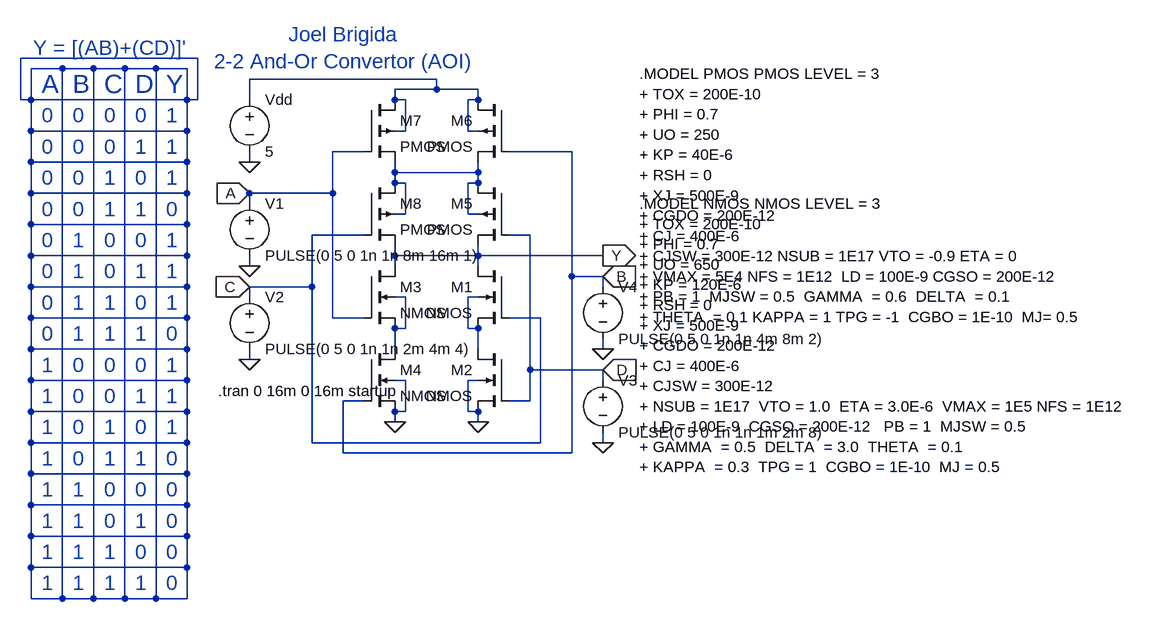
[diagram p0: schematic AOI2-2.asc]
AOI2-2.asc, the LTspice schematic file:
Version 4
SHEET 1 1204 680
WIRE -80 -208 -352 -208
WIRE -288 -192 -336 -192
WIRE -240 -192 -288 -192
WIRE -192 -192 -240 -192
WIRE -144 -192 -192 -192
WIRE -96 -192 -144 -192
WIRE 288 -176 0 -176
WIRE 288 -160 288 -176
WIRE 288 -160 224 -160
WIRE 352 -160 288 -160
WIRE -352 -144 -352 -208
WIRE -336 -144 -336 -192
WIRE -336 -144 -352 -144
WIRE -96 -144 -96 -192
WIRE -96 -144 -336 -144
WIRE -80 -144 -80 -208
WIRE -80 -144 -96 -144
WIRE 0 -144 0 -176
WIRE 224 -144 224 -160
WIRE 240 -144 224 -144
WIRE 352 -144 352 -160
WIRE 352 -144 336 -144
WIRE -336 -96 -336 -144
WIRE -96 -96 -96 -144
WIRE -96 -96 -336 -96
WIRE 240 -96 240 -144
WIRE 240 -96 224 -96
WIRE 336 -96 336 -144
WIRE 352 -96 336 -96
WIRE 176 -64 128 -64
WIRE 496 -64 400 -64
WIRE -336 -48 -336 -96
WIRE -96 -48 -96 -96
WIRE -96 -48 -336 -48
WIRE 0 -48 0 -64
WIRE 224 -32 224 -48
WIRE 352 -32 352 -48
WIRE 352 -32 224 -32
WIRE 224 -16 224 -32
WIRE 240 -16 224 -16
WIRE 352 -16 352 -32
WIRE 352 -16 336 -16
WIRE -336 0 -336 -48
WIRE -96 0 -96 -48
WIRE -96 0 -336 0
WIRE 128 0 128 -64
WIRE 128 0 0 0
WIRE 0 16 0 0
WIRE 240 32 240 -16
WIRE 240 32 224 32
WIRE 336 32 336 -16
WIRE 352 32 336 32
WIRE -336 48 -336 0
WIRE -96 48 -96 0
WIRE -96 48 -336 48
WIRE 176 64 96 64
WIRE 432 64 400 64
WIRE -336 96 -336 48
WIRE -96 96 -96 48
WIRE -96 96 -336 96
WIRE 224 96 224 80
WIRE 352 96 352 80
WIRE 352 96 224 96
WIRE 544 96 352 96
WIRE 0 112 0 96
WIRE 224 112 224 96
WIRE 352 112 352 96
WIRE 496 128 496 -64
WIRE 544 128 496 128
WIRE -336 144 -336 96
WIRE -96 144 -96 96
WIRE -96 144 -336 144
WIRE 96 144 96 64
WIRE 96 144 0 144
WIRE 544 144 544 128
WIRE 0 160 0 144
WIRE 240 160 224 160
WIRE 352 160 336 160
WIRE -336 192 -336 144
WIRE -96 192 -96 144
WIRE -96 192 -336 192
WIRE 128 192 128 0
WIRE 176 192 128 192
WIRE 448 192 400 192
WIRE 240 208 240 160
WIRE 240 208 224 208
WIRE 336 208 336 160
WIRE 352 208 336 208
WIRE -336 240 -336 192
WIRE -96 240 -96 192
WIRE -96 240 -336 240
WIRE 224 240 224 208
WIRE 352 240 352 208
WIRE 544 240 544 224
WIRE 0 256 0 240
WIRE 432 272 432 64
WIRE 544 272 432 272
WIRE -336 288 -336 240
WIRE -96 288 -96 240
WIRE -96 288 -336 288
WIRE 240 288 224 288
WIRE 352 288 336 288
WIRE 544 288 544 272
WIRE 176 320 144 320
WIRE 432 320 432 272
WIRE 432 320 400 320
WIRE -336 336 -336 288
WIRE -96 336 -96 288
WIRE -96 336 -336 336
WIRE 240 336 240 288
WIRE 240 336 224 336
WIRE 336 336 336 288
WIRE 352 336 336 336
WIRE 224 352 224 336
WIRE 352 352 352 336
WIRE -336 384 -336 336
WIRE -96 384 -96 336
WIRE -96 384 -336 384
WIRE 96 384 96 144
WIRE 448 384 448 192
WIRE 448 384 96 384
WIRE 544 384 544 368
WIRE 144 400 144 320
WIRE 496 400 496 128
WIRE 496 400 144 400
WIRE -336 432 -336 384
WIRE -96 432 -96 384
WIRE -96 432 -336 432
WIRE -336 480 -336 432
WIRE -96 480 -96 432
WIRE -96 480 -336 480
WIRE -336 528 -336 480
WIRE -96 528 -96 480
WIRE -96 528 -336 528
WIRE -336 576 -336 528
WIRE -96 576 -96 528
WIRE -96 576 -336 576
WIRE -336 624 -336 576
WIRE -288 624 -288 -192
WIRE -288 624 -336 624
WIRE -240 624 -240 -192
WIRE -240 624 -288 624
WIRE -192 624 -192 -192
WIRE -192 624 -240 624
WIRE -144 624 -144 -192
WIRE -144 624 -192 624
WIRE -96 624 -96 576
WIRE -96 624 -144 624
WIRE 0 0 0 0
FLAG 224 352 0
FLAG 352 352 0
FLAG 0 -48 0
FLAG 544 96 Y
IOPIN 544 96 Out
FLAG 0 0 A
IOPIN 0 0 In
FLAG 0 112 0
FLAG 0 256 0
FLAG 0 144 C
IOPIN 0 144 In
FLAG 544 240 0
FLAG 544 384 0
FLAG 544 128 B
IOPIN 544 128 In
FLAG 544 272 D
IOPIN 544 272 In
SYMBOL nmos4 400 112 M0
SYMATTR InstName M1
SYMBOL nmos4 400 240 M0
SYMATTR InstName M2
SYMBOL nmos4 176 112 R0
SYMATTR InstName M3
SYMBOL nmos4 176 240 R0
SYMATTR InstName M4
SYMBOL pmos4 400 -16 M0
SYMATTR InstName M5
SYMBOL pmos4 400 -144 M0
SYMATTR InstName M6
SYMBOL pmos4 176 -144 R0
SYMATTR InstName M7
SYMBOL pmos4 176 -16 R0
SYMATTR InstName M8
SYMBOL voltage 0 -160 R0
SYMATTR InstName Vdd
SYMATTR Value 5
SYMBOL voltage 0 0 R0
WINDOW 123 0 0 Left 0
WINDOW 39 0 0 Left 0
SYMATTR InstName V1
SYMATTR Value PULSE(0 5 0 1n 1n 8m 16m 1)
SYMBOL voltage 0 144 R0
WINDOW 123 0 0 Left 0
WINDOW 39 0 0 Left 0
SYMATTR InstName V2
SYMATTR Value PULSE(0 5 0 1n 1n 2m 4m 4)
SYMBOL voltage 544 272 R0
WINDOW 123 0 0 Left 0
WINDOW 39 0 0 Left 0
SYMATTR InstName V3
SYMATTR Value PULSE(0 5 0 1n 1n 1m 2m 8)
SYMBOL voltage 544 128 R0
WINDOW 123 0 0 Left 0
WINDOW 39 0 0 Left 0
SYMATTR InstName V4
SYMATTR Value PULSE(0 5 0 1n 1n 4m 8m 2)
TEXT 144 -224 Center 3 ;Joel Brigida\n2-2 And-Or Convertor (AOI)
TEXT 600 -184 Left 2 !.MODEL PMOS PMOS LEVEL = 3\n+ TOX = 200E-10\n+ PHI = 0.7\n+ UO = 250 \n+ KP = 40E-6\n+ RSH = 0\n+ XJ = 500E-9 \n+ CGDO = 200E-12 \n+ CJ = 400E-6\n+ CJSW = 300E-12 NSUB = 1E17 VTO = -0.9 ETA = 0\n+ VMAX = 5E4 NFS = 1E12  LD = 100E-9 CGSO = 200E-12\n+ PB = 1  MJSW = 0.5  GAMMA  = 0.6  DELTA  = 0.1\n+ THETA  = 0.1 KAPPA = 1 TPG = -1  CGBO = 1E-10  MJ= 0.5
TEXT 600 16 Left 2 !.MODEL NMOS NMOS LEVEL = 3\n+ TOX = 200E-10\n+ PHI = 0.7\n+ UO = 650\n+ KP = 120E-6\n+ RSH = 0\n+ XJ = 500E-9\n+ CGDO = 200E-12\n+ CJ = 400E-6\n+ CJSW = 300E-12\n+ NSUB = 1E17  VTO = 1.0  ETA = 3.0E-6  VMAX = 1E5 NFS = 1E12   \n+ LD = 100E-9  CGSO = 200E-12   PB = 1  MJSW = 0.5\n+ GAMMA  = 0.5  DELTA  = 3.0  THETA  = 0.1\n+ KAPPA  = 0.3  TPG = 1  CGBO = 1E-10  MJ = 0.5
TEXT -48 304 Left 2 !.tran 0 16m 0 16m startup
TEXT -216 -224 Center 3 ;Y = [(AB)+(CD)]'
TEXT -320 -168 Left 4 ;A
TEXT -272 -168 Left 4 ;B
TEXT -224 -168 Left 4 ;C
TEXT -176 -168 Left 4 ;D
TEXT -128 -168 Left 4 ;Y
TEXT -320 -120 Left 3 ;0
TEXT -320 -72 Left 3 ;0
TEXT -320 -24 Left 3 ;0
TEXT -320 24 Left 3 ;0
TEXT -320 72 Left 3 ;0
TEXT -320 120 Left 3 ;0
TEXT -320 168 Left 3 ;0
TEXT -320 216 Left 3 ;0
TEXT -272 -120 Left 3 ;0
TEXT -272 -72 Left 3 ;0
TEXT -272 -24 Left 3 ;0
TEXT -272 24 Left 3 ;0
TEXT -272 264 Left 3 ;0
TEXT -272 312 Left 3 ;0
TEXT -272 360 Left 3 ;0
TEXT -272 408 Left 3 ;0
TEXT -224 -120 Left 3 ;0
TEXT -224 -72 Left 3 ;0
TEXT -224 72 Left 3 ;0
TEXT -224 120 Left 3 ;0
TEXT -224 216 Left 3 ;1
TEXT -224 264 Left 3 ;0
TEXT -224 456 Left 3 ;0
TEXT -224 504 Left 3 ;0
TEXT -224 312 Left 3 ;0
TEXT -224 168 Left 3 ;1
TEXT -224 24 Left 3 ;1
TEXT -224 -24 Left 3 ;1
TEXT -224 408 Left 3 ;1
TEXT -224 360 Left 3 ;1
TEXT -224 600 Left 3 ;1
TEXT -224 552 Left 3 ;1
TEXT -272 120 Left 3 ;1
TEXT -272 72 Left 3 ;1
TEXT -272 216 Left 3 ;1
TEXT -272 168 Left 3 ;1
TEXT -272 504 Left 3 ;1
TEXT -272 456 Left 3 ;1
TEXT -272 600 Left 3 ;1
TEXT -272 552 Left 3 ;1
TEXT -320 312 Left 3 ;1
TEXT -320 264 Left 3 ;1
TEXT -320 408 Left 3 ;1
TEXT -320 360 Left 3 ;1
TEXT -320 456 Left 3 ;1
TEXT -320 552 Left 3 ;1
TEXT -320 504 Left 3 ;1
TEXT -320 600 Left 3 ;1
TEXT -176 -72 Left 3 ;1
TEXT -176 24 Left 3 ;1
TEXT -176 120 Left 3 ;1
TEXT -176 216 Left 3 ;1
TEXT -176 312 Left 3 ;1
TEXT -176 408 Left 3 ;1
TEXT -176 504 Left 3 ;1
TEXT -176 600 Left 3 ;1
TEXT -176 -120 Left 3 ;0
TEXT -176 -24 Left 3 ;0
TEXT -176 72 Left 3 ;0
TEXT -176 168 Left 3 ;0
TEXT -176 264 Left 3 ;0
TEXT -176 360 Left 3 ;0
TEXT -176 456 Left 3 ;0
TEXT -176 552 Left 3 ;0
TEXT -128 24 Left 3 ;0
TEXT -128 -120 Left 3 ;1
TEXT -128 -24 Left 3 ;1
TEXT -128 -72 Left 3 ;1
TEXT -128 216 Left 3 ;0
TEXT -128 72 Left 3 ;1
TEXT -128 168 Left 3 ;1
TEXT -128 120 Left 3 ;1
TEXT -128 408 Left 3 ;0
TEXT -128 264 Left 3 ;1
TEXT -128 360 Left 3 ;1
TEXT -128 312 Left 3 ;1
TEXT -128 456 Left 3 ;0
TEXT -128 504 Left 3 ;0
TEXT -128 552 Left 3 ;0
TEXT -128 600 Left 3 ;0

The netlist it stands for:
* AOI2-2.asc
M1 Y C N005 N005 NMOS
M2 N005 D 0 0 NMOS
M3 Y A N004 N004 NMOS
M4 N004 B 0 0 NMOS
M5 N003 D Y N003 PMOS
M6 N002 B N003 N002 PMOS
M7 N002 A N003 N002 PMOS
M8 N003 C Y N003 PMOS
Vdd N002 0 5
V1 A 0 PULSE(0 5 0 1n 1n 8m 16m 1)
V2 C 0 PULSE(0 5 0 1n 1n 2m 4m 4)
V3 D 0 PULSE(0 5 0 1n 1n 1m 2m 8)
V4 B 0 PULSE(0 5 0 1n 1n 4m 8m 2)
.model NMOS NMOS
.model PMOS PMOS
.lib standard.mos
* Joel Brigida
* 2-2 And-Or Convertor (AOI)
.MODEL PMOS PMOS LEVEL = 3
+ TOX = 200E-10
+ PHI = 0.7
+ UO = 250
+ KP = 40E-6
+ RSH = 0
+ XJ = 500E-9
+ CGDO = 200E-12
+ CJ = 400E-6
+ CJSW = 300E-12 NSUB = 1E17 VTO = -0.9 ETA = 0
+ VMAX = 5E4 NFS = 1E12  LD = 100E-9 CGSO = 200E-12
+ PB = 1  MJSW = 0.5  GAMMA  = 0.6  DELTA  = 0.1
+ THETA  = 0.1 KAPPA = 1 TPG = -1  CGBO = 1E-10  MJ= 0.5
.MODEL NMOS NMOS LEVEL = 3
+ TOX = 200E-10
+ PHI = 0.7
+ UO = 650
+ KP = 120E-6
+ RSH = 0
+ XJ = 500E-9
+ CGDO = 200E-12
+ CJ = 400E-6
+ CJSW = 300E-12
+ NSUB = 1E17  VTO = 1.0  ETA = 3.0E-6  VMAX = 1E5 NFS = 1E12
+ LD = 100E-9  CGSO = 200E-12   PB = 1  MJSW = 0.5
+ GAMMA  = 0.5  DELTA  = 3.0  THETA  = 0.1
+ KAPPA  = 0.3  TPG = 1  CGBO = 1E-10  MJ = 0.5
.tran 0 16m 0 16m startup
* Y = [(AB)+(CD)]'
* A
* B
* C
* D
* Y
* 0
* 0
* 0
* 0
* 0
* 0
* 0
* 0
* 0
* 0
* 0
* 0
* 0
* 0
* 0
* 0
* 0
* 0
* 0
* 0
* 1
* 0
* 0
* 0
* 0
* 1
* 1
* 1
* 1
* 1
* 1
* 1
* 1
* 1
* 1
* 1
* 1
* 1
* 1
* 1
* 1
* 1
* 1
* 1
* 1
* 1
* 1
* 1
* 1
* 1
* 1
* 1
* 1
* 1
* 1
* 1
* 0
* 0
* 0
* 0
* 0
* 0
* 0
* 0
* 0
* 1
* 1
* 1
* 0
* 1
* 1
* 1
* 0
* 1
* 1
* 1
* 0
* 0
* 0
* 0
.backanno
.end